# EAGLE design cm3_basic (EAGLE 9.4.2)

## Sheet 1 of 2
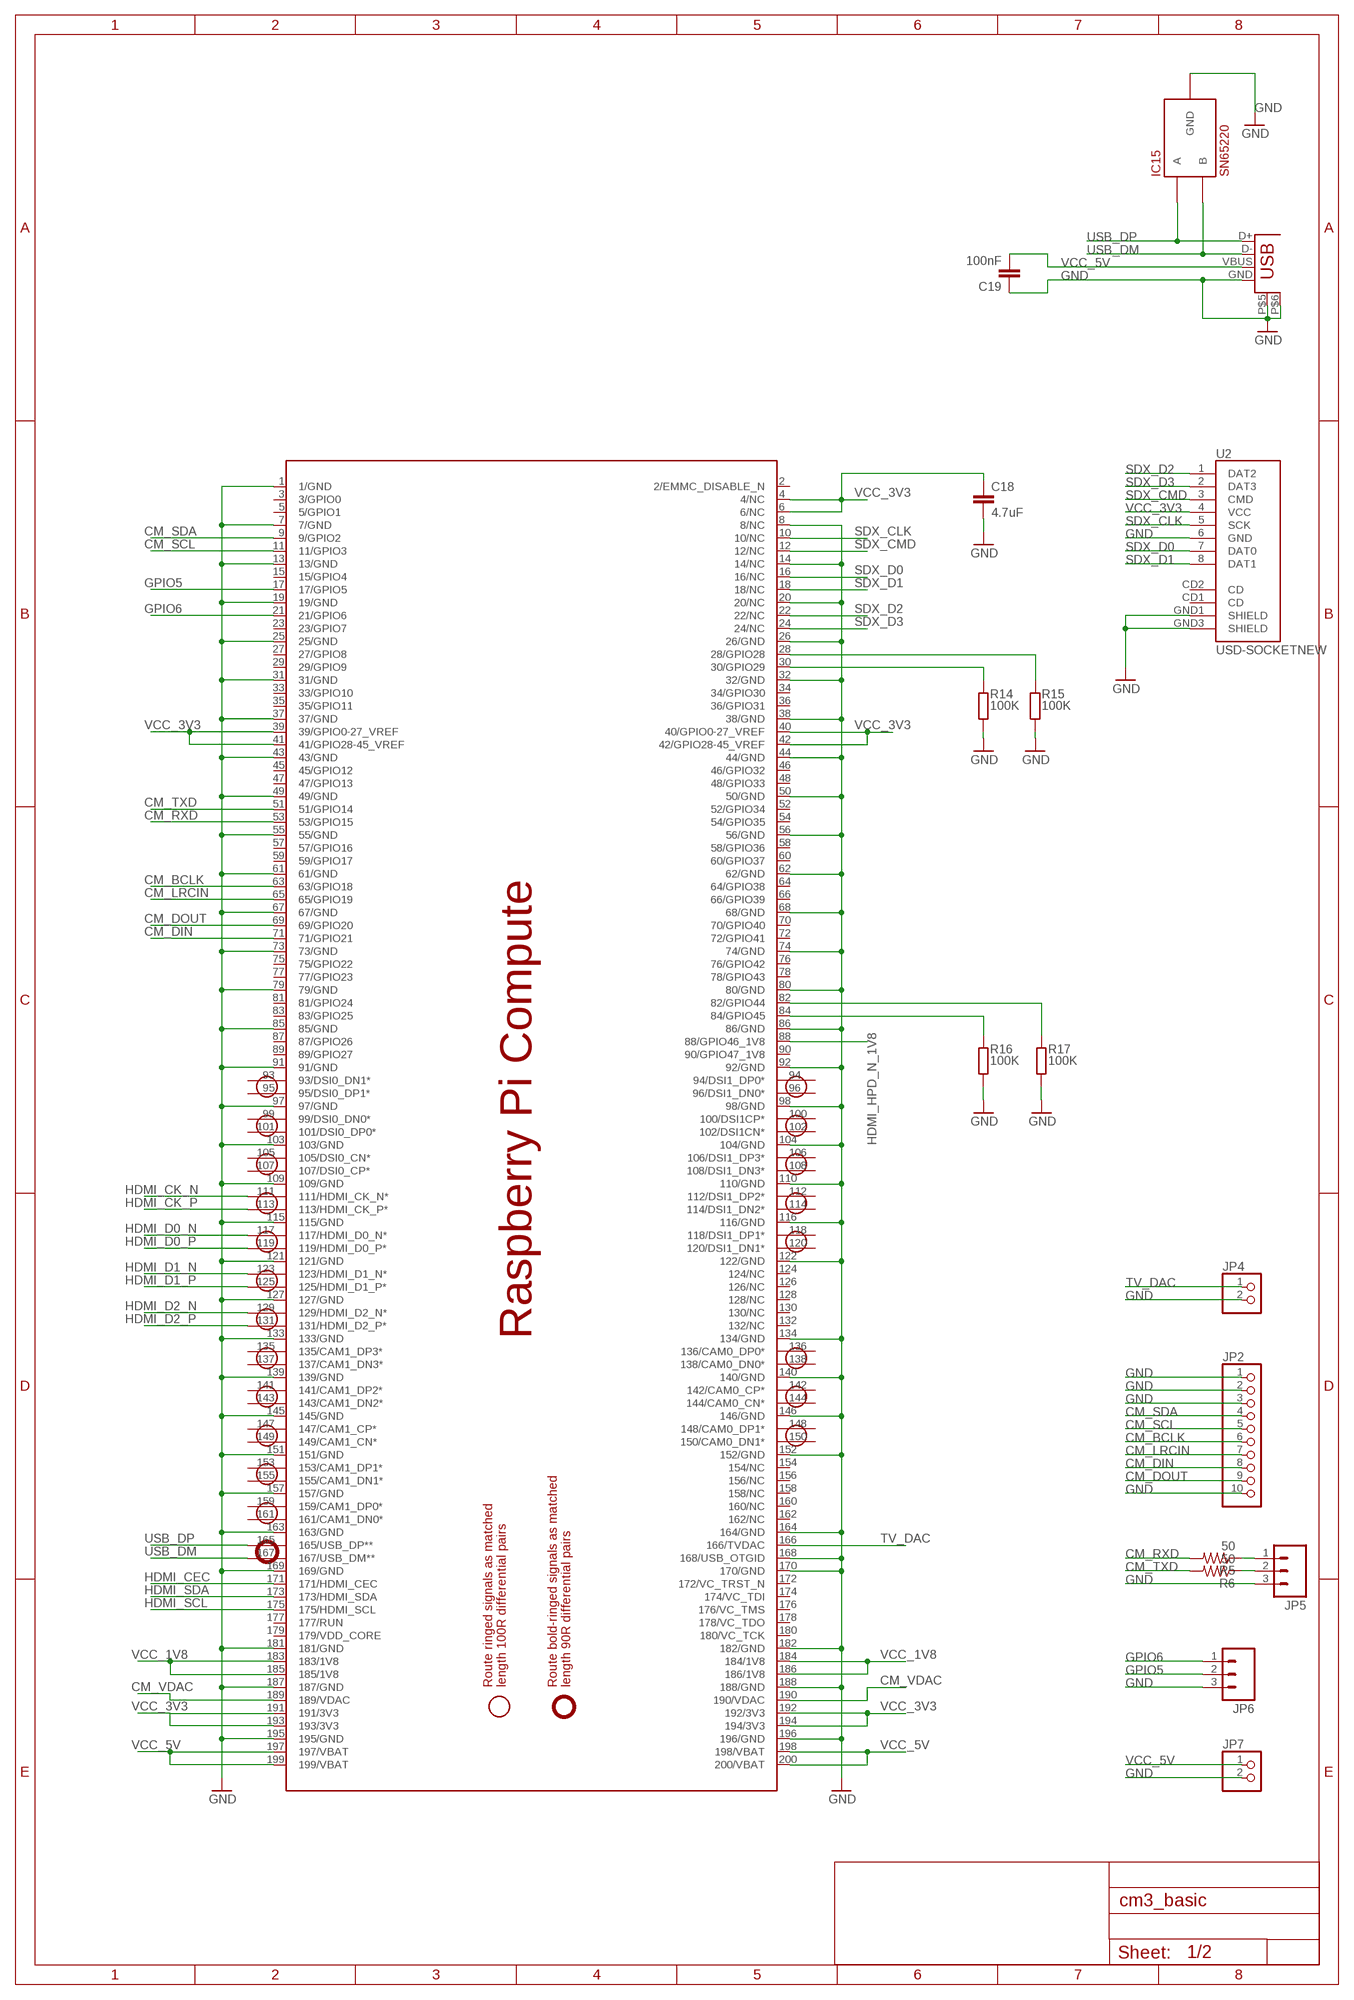
[diagram p0: schematic, sheet 1]

### Parts
C18  4.7uF  C-EUC1608  [C1608]
C19  100nF  CAP0603-CAP  [0603-CAP]
IC15  SN65220  [SOT23-6L]
JP2  PINHD-1X10  [1X10]
JP3  USB-A  USB-A-SMD  [USB-A-S-NOSILK-FEMALE]
JP4  PINHD-1X2  [1X02]
JP5  M03LOCK_LONGPADS  [1X03_LOCK_LONGPADS]
JP6  M03LOCK_LONGPADS  [1X03_LOCK_LONGPADS]
JP7  PINHD-1X2  [1X02]
R5  50  RESISTOR0603-RES  [0603-RES]
R6  50  RESISTOR0603-RES  [0603-RES]
R14  100K  R-EU_R0603  [R0603]
R15  100K  R-EU_R0603  [R0603]
R16  100K  R-EU_R0603  [R0603]
R17  100K  R-EU_R0603  [R0603]
SODIMM  RPI_COMPUTE  [RPI_COMPUTE]
U2  USD-SOCKETNEW  [MICRO-SD-SOCKET-PP]

### Nets
CM_BCLK: JP2.6 SODIMM.63(63/GPIO18)
CM_DIN: JP2.8 SODIMM.71(71/GPIO21)
CM_DOUT: JP2.9 SODIMM.69(69/GPIO20)
CM_LRCIN: JP2.7 SODIMM.65(65/GPIO19)
CM_RXD: R5.2 SODIMM.53(53/GPIO15)
CM_SCL: JP2.5 SODIMM.11(11/GPIO3)
CM_SDA: JP2.4 SODIMM.9(9/GPIO2)
CM_TXD: R6.2 SODIMM.51(51/GPIO14)
CM_VDAC: SODIMM.189(189/VDAC) SODIMM.190(190/VDAC) ; also sheet 2
GND: C18.2 C19.1 IC15.2(GND) IC15.5(GND) JP2.1 JP2.2 JP2.3 JP2.10 JP3.GND JP3.P$5(SHIELD1) JP3.P$6(SHIELD2) JP4.2 JP5.3 JP6.3 JP7.2 R14.1 R15.1 R16.1 R17.1 SODIMM.1(1/GND) SODIMM.7(7/GND) SODIMM.8(8/NC) SODIMM.13(13/GND) SODIMM.14(14/NC) SODIMM.19(19/GND) SODIMM.20(20/NC) SODIMM.25(25/GND) SODIMM.26(26/GND) SODIMM.31(31/GND) SODIMM.32(32/GND) SODIMM.37(37/GND) SODIMM.38(38/GND) SODIMM.43(43/GND) SODIMM.44(44/GND) SODIMM.49(49/GND) SODIMM.50(50/GND) SODIMM.55(55/GND) SODIMM.56(56/GND) SODIMM.61(61/GND) SODIMM.62(62/GND) SODIMM.67(67/GND) SODIMM.68(68/GND) SODIMM.73(73/GND) SODIMM.74(74/GND) SODIMM.79(79/GND) SODIMM.80(80/GND) SODIMM.85(85/GND) SODIMM.86(86/GND) SODIMM.91(91/GND) SODIMM.92(92/GND) SODIMM.97(97/GND) SODIMM.98(98/GND) SODIMM.103(103/GND) SODIMM.104(104/GND) SODIMM.109(109/GND) SODIMM.110(110/GND) SODIMM.115(115/GND) SODIMM.116(116/GND) SODIMM.121(121/GND) SODIMM.122(122/GND) SODIMM.127(127/GND) SODIMM.133(133/GND) SODIMM.134(134/GND) SODIMM.139(139/GND) SODIMM.140(140/GND) SODIMM.145(145/GND) SODIMM.146(146/GND) SODIMM.151(151/GND) SODIMM.152(152/GND) SODIMM.157(157/GND) SODIMM.163(163/GND) SODIMM.164(164/GND) SODIMM.168(168/USB_OTGID) SODIMM.169(169/GND) SODIMM.170(170/GND) SODIMM.181(181/GND) SODIMM.182(182/GND) SODIMM.187(187/GND) SODIMM.188(188/GND) SODIMM.195(195/GND) SODIMM.196(196/GND) U2.6(GND) U2.GND1(SHIELD) U2.GND3(SHIELD) ; also sheet 2
GPIO5: JP6.2 SODIMM.17(17/GPIO5)
GPIO6: JP6.1 SODIMM.21(21/GPIO6)
HDMI_CEC: SODIMM.171(171/HDMI_CEC) ; also sheet 2
HDMI_CK_N: SODIMM.111(111/HDMI_CK_N*) ; also sheet 2
HDMI_CK_P: SODIMM.113(113/HDMI_CK_P*) ; also sheet 2
HDMI_D0_N: SODIMM.117(117/HDMI_D0_N*) ; also sheet 2
HDMI_D0_P: SODIMM.119(119/HDMI_D0_P*) ; also sheet 2
HDMI_D1_N: SODIMM.123(123/HDMI_D1_N*) ; also sheet 2
HDMI_D1_P: SODIMM.125(125/HDMI_D1_P*) ; also sheet 2
HDMI_D2_N: SODIMM.129(129/HDMI_D2_N*) ; also sheet 2
HDMI_D2_P: SODIMM.131(131/HDMI_D2_P*) ; also sheet 2
HDMI_HPD_N_1V8: SODIMM.88(88/GPIO46_1V8) ; also sheet 2
HDMI_SCL: SODIMM.175(175/HDMI_SCL) ; also sheet 2
HDMI_SDA: SODIMM.173(173/HDMI_SDA) ; also sheet 2
N$3: JP5.1 R5.1
N$4: JP5.2 R6.1
N$8: R16.2 SODIMM.84(84/GPIO45)
N$9: R15.2 SODIMM.28(28/GPIO28)
N$10: R14.2 SODIMM.30(30/GPIO29)
N$11: R17.2 SODIMM.82(82/GPIO44)
SDX_CLK: SODIMM.10(10/NC) U2.5(SCK)
SDX_CMD: SODIMM.12(12/NC) U2.3(CMD)
SDX_D0: SODIMM.16(16/NC) U2.7(DAT0)
SDX_D1: SODIMM.18(18/NC) U2.8(DAT1)
SDX_D2: SODIMM.22(22/NC) U2.1(DAT2)
SDX_D3: SODIMM.24(24/NC) U2.2(DAT3)
TV_DAC: JP4.1 SODIMM.166(166/TVDAC)
USB_DM: IC15.4(B) JP3.D- SODIMM.167(167/USB_DM**)
USB_DP: IC15.6(A) JP3.D+ SODIMM.165(165/USB_DP**)
VCC_1V8: SODIMM.183(183/1V8) SODIMM.184(184/1V8) SODIMM.185(185/1V8) SODIMM.186(186/1V8) ; also sheet 2
VCC_3V3: C18.1 SODIMM.4(4/NC) SODIMM.6(6/NC) SODIMM.39(39/GPIO0-27_VREF) SODIMM.40(40/GPIO0-27_VREF) SODIMM.41(41/GPIO28-45_VREF) SODIMM.42(42/GPIO28-45_VREF) SODIMM.191(191/3V3) SODIMM.192(192/3V3) SODIMM.193(193/3V3) SODIMM.194(194/3V3) U2.4(VCC) ; also sheet 2
VCC_5V: C19.2 JP3.VBUS JP7.1 SODIMM.197(197/VBAT) SODIMM.198(198/VBAT) SODIMM.199(199/VBAT) SODIMM.200(200/VBAT) ; also sheet 2
Unconnected: SODIMM.2(2/EMMC_DISABLE_N) SODIMM.3(3/GPIO0) SODIMM.5(5/GPIO1) SODIMM.15(15/GPIO4) SODIMM.23(23/GPIO7) SODIMM.27(27/GPIO8) SODIMM.29(29/GPIO9) SODIMM.33(33/GPIO10) SODIMM.34(34/GPIO30) SODIMM.35(35/GPIO11) SODIMM.36(36/GPIO31) SODIMM.45(45/GPIO12) SODIMM.46(46/GPIO32) SODIMM.47(47/GPIO13) SODIMM.48(48/GPIO33) SODIMM.52(52/GPIO34) SODIMM.54(54/GPIO35) SODIMM.57(57/GPIO16) SODIMM.58(58/GPIO36) SODIMM.59(59/GPIO17) SODIMM.60(60/GPIO37) SODIMM.64(64/GPIO38) SODIMM.66(66/GPIO39) SODIMM.70(70/GPIO40) SODIMM.72(72/GPIO41) SODIMM.75(75/GPIO22) SODIMM.76(76/GPIO42) SODIMM.77(77/GPIO23) SODIMM.78(78/GPIO43) SODIMM.81(81/GPIO24) SODIMM.83(83/GPIO25) SODIMM.87(87/GPIO26) SODIMM.89(89/GPIO27) SODIMM.90(90/GPIO47_1V8) SODIMM.93(93/DSI0_DN1*) SODIMM.94(94/DSI1_DP0*) SODIMM.95(95/DSI0_DP1*) SODIMM.96(96/DSI1_DN0*) SODIMM.99(99/DSI0_DN0*) SODIMM.100(100/DSI1CP*) SODIMM.101(101/DSI0_DP0*) SODIMM.102(102/DSI1CN*) SODIMM.105(105/DSI0_CN*) SODIMM.106(106/DSI1_DP3*) SODIMM.107(107/DSI0_CP*) SODIMM.108(108/DSI1_DN3*) SODIMM.112(112/DSI1_DP2*) SODIMM.114(114/DSI1_DN2*) SODIMM.118(118/DSI1_DP1*) SODIMM.120(120/DSI1_DN1*) SODIMM.124(124/NC) SODIMM.126(126/NC) SODIMM.128(128/NC) SODIMM.130(130/NC) SODIMM.132(132/NC) SODIMM.135(135/CAM1_DP3*) SODIMM.136(136/CAM0_DP0*) SODIMM.137(137/CAM1_DN3*) SODIMM.138(138/CAM0_DN0*) SODIMM.141(141/CAM1_DP2*) SODIMM.142(142/CAM0_CP*) SODIMM.143(143/CAM1_DN2*) SODIMM.144(144/CAM0_CN*) SODIMM.147(147/CAM1_CP*) SODIMM.148(148/CAM0_DP1*) SODIMM.149(149/CAM1_CN*) SODIMM.150(150/CAM0_DN1*) SODIMM.153(153/CAM1_DP1*) SODIMM.154(154/NC) SODIMM.155(155/CAM1_DN1*) SODIMM.156(156/NC) SODIMM.158(158/NC) SODIMM.159(159/CAM1_DP0*) SODIMM.160(160/NC) SODIMM.161(161/CAM1_DN0*) SODIMM.162(162/NC) SODIMM.172(172/VC_TRST_N) SODIMM.174(174/VC_TDI) SODIMM.176(176/VC_TMS) SODIMM.177(177/RUN) SODIMM.178(178/VC_TDO) SODIMM.179(179/VDD_CORE) SODIMM.180(180/VC_TCK) U2.CD1(CD) U2.CD2(CD)

## Sheet 2 of 2
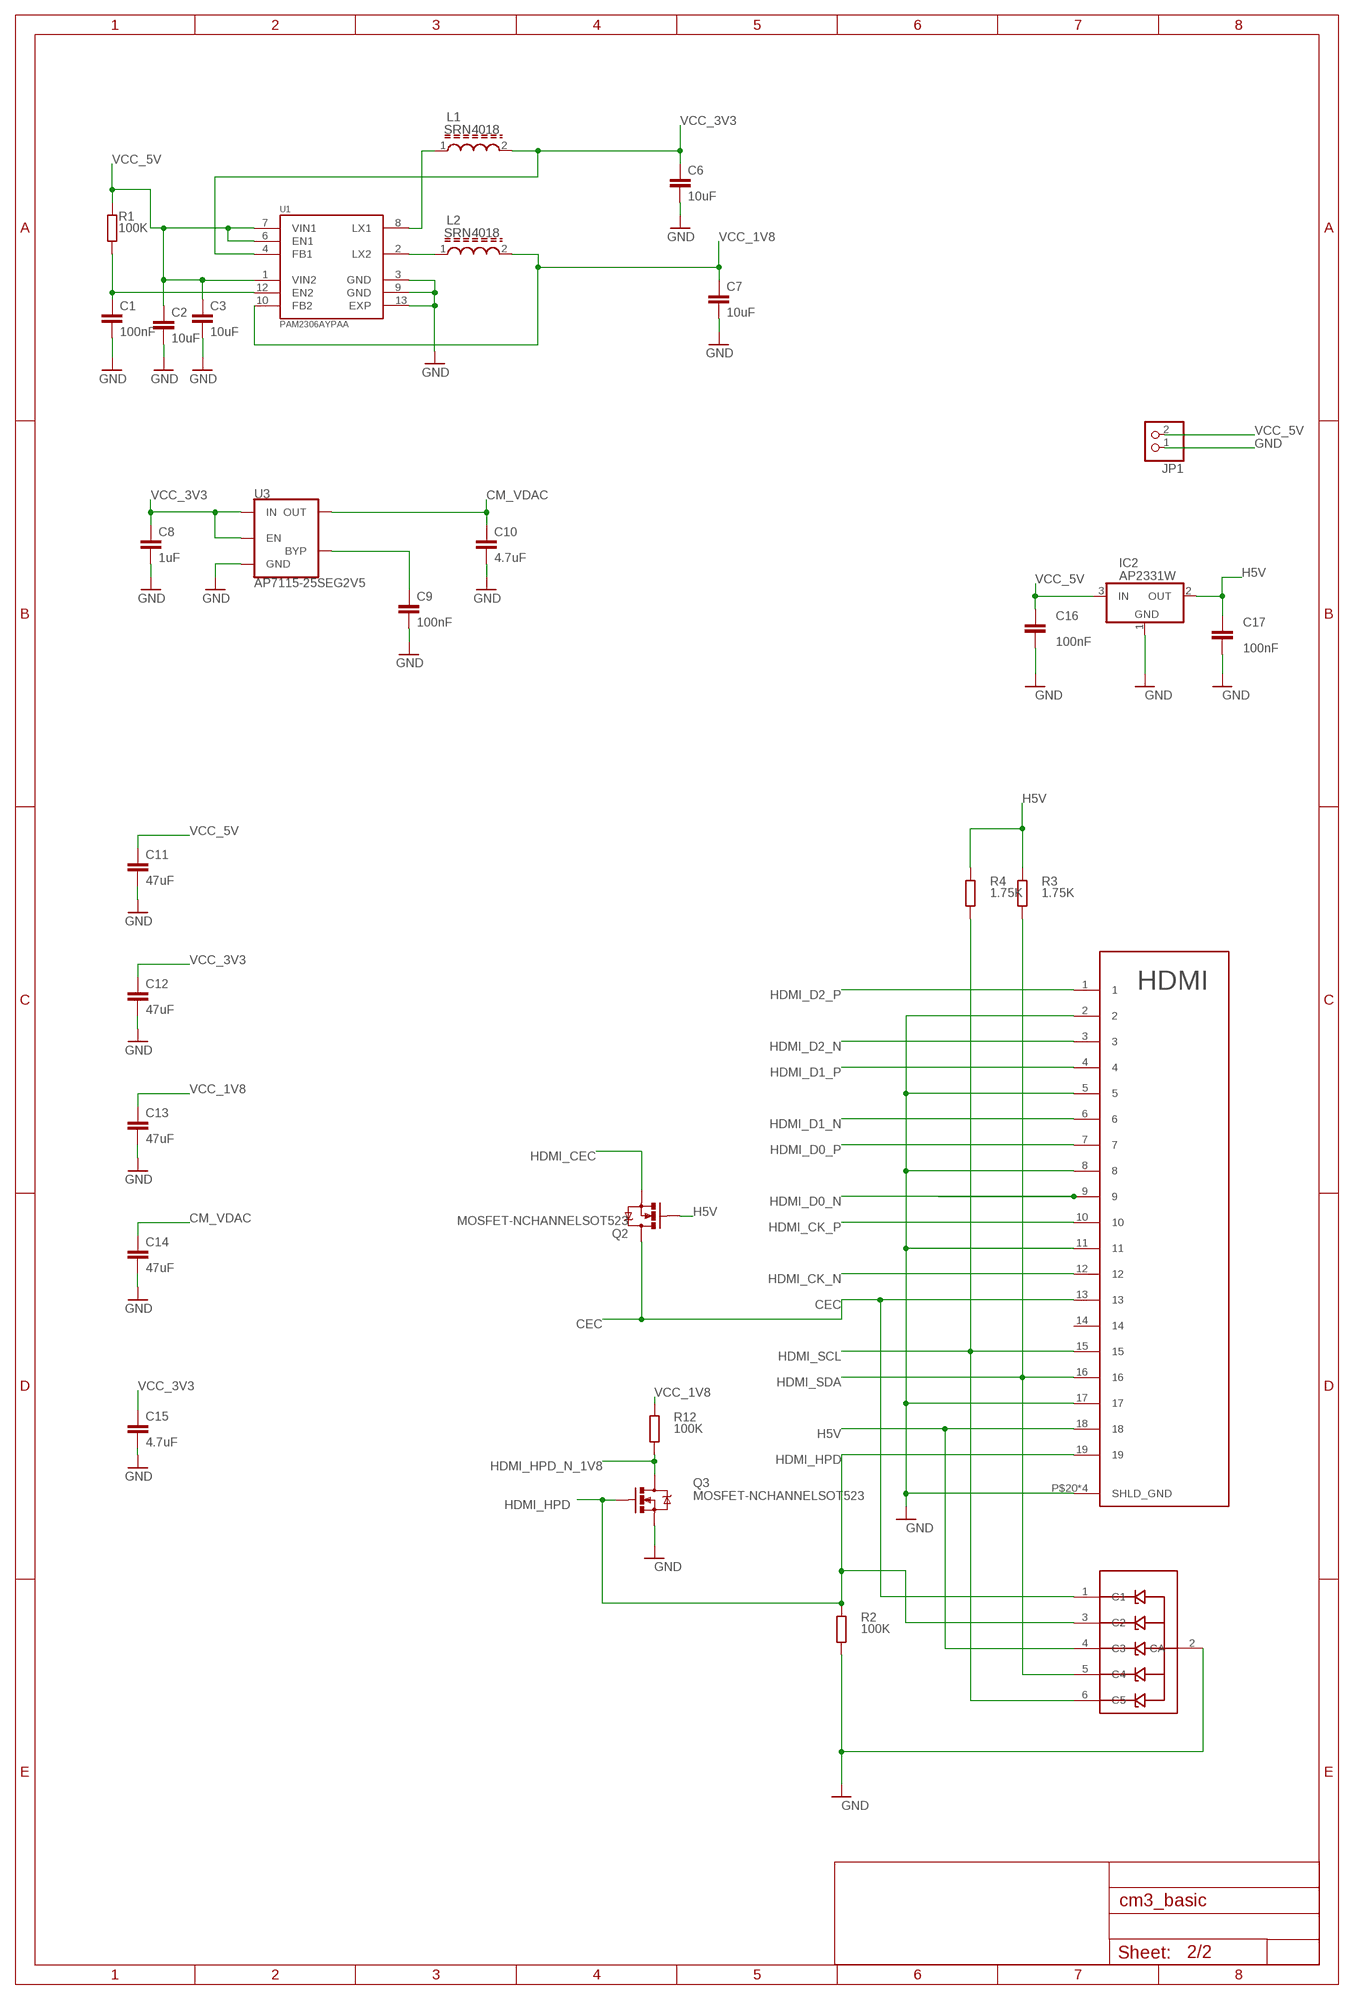
[diagram p1: schematic, sheet 2]

### Parts
C1  100nF  C-EUC0603  [C0603]
C2  10uF  C-EUC0805  [C0805]
C3  10uF  C-EUC0805  [C0805]
C6  10uF  C-EUC0805  [C0805]
C7  10uF  C-EUC0805  [C0805]
C8  1uF  C-EUC0603  [C0603]
C9  100nF  C-EUC0603  [C0603]
C10  4.7uF  C-EUC0603  [C0603]
C11  47uF  C-EUC3216  [C3216]
C12  47uF  C-EUC3216  [C3216]
C13  47uF  C-EUC3216  [C3216]
C14  47uF  C-EUC3216  [C3216]
C15  4.7uF  C-EUC0603  [C0603]
C16  100nF  C-EUC0603  [C0603]
C17  100nF  C-EUC0603  [C0603]
IC1  PESD3V3L5UYSOT363  [SOT363-INFINION]
IC2  AP2331W  AP2331WCB  [SOT23]
JP1  PINHD-1X2  [1X02]
L1  SRN4018  [INDP4040X180N]
L2  SRN4018  [INDP4040X180N]
Q2  MOSFET-NCHANNELSOT523  [SOT523]
Q3  MOSFET-NCHANNELSOT523  [SOT523]
R1  100K  R-EU_R0603  [R0603]
R2  100K  R-EU_R0603  [R0603]
R3  1.75K  R-EU_R0603  [R0603]
R4  1.75K  R-EU_R0603  [R0603]
R12  100K  R-EU_R0603  [R0603]
U1  PAM2306AYPAA  [SON45P300X300X80-13N]
U3  AP7115-25SEG2V5  [SC70]
U4  HDMI  [HDMI]

### Nets
CEC: IC1.1(C1) Q2.3(D) U4.13
CM_VDAC: C10.1 C14.1 U3.5(OUT) ; also sheet 1
GND: C1.2 C2.2 C3.2 C6.2 C7.2 C8.2 C9.2 C10.2 C11.2 C12.2 C13.2 C14.2 C15.2 C16.2 C17.2 IC1.2(CA) IC2.1(GND) JP1.1 Q3.2(S) R2.1 U1.3(GND) U1.9(GND) U1.13(EXP) U3.2(GND) U4.2 U4.5 U4.8 U4.11 U4.17 U4.P$20(SHLD_GND) U4.P$21(SHLD_GND) U4.P$22(SHLD_GND) U4.P$23(SHLD_GND) ; also sheet 1
H5V: C17.1 IC1.4(C3) IC2.2(OUT) Q2.1(G) R3.2 R4.2 U4.18
HDMI_CEC: Q2.2(S) ; also sheet 1
HDMI_CK_N: U4.12 ; also sheet 1
HDMI_CK_P: U4.10 ; also sheet 1
HDMI_D0_N: U4.9 ; also sheet 1
HDMI_D0_P: U4.7 ; also sheet 1
HDMI_D1_N: U4.6 ; also sheet 1
HDMI_D1_P: U4.4 ; also sheet 1
HDMI_D2_N: U4.3 ; also sheet 1
HDMI_D2_P: U4.1 ; also sheet 1
HDMI_HPD: IC1.3(C2) Q3.1(G) R2.2 U4.19
HDMI_HPD_N_1V8: Q3.3(D) R12.1 ; also sheet 1
HDMI_SCL: IC1.6(C5) R4.1 U4.15 ; also sheet 1
HDMI_SDA: IC1.5(C4) R3.1 U4.16 ; also sheet 1
N$1: L1.1 U1.8(LX1)
N$2: C1.1 R1.1 U1.12(EN2)
N$5: L2.1 U1.2(LX2)
N$7: C9.1 U3.4(BYP)
VCC_1V8: C7.1 C13.1 L2.2 R12.2 U1.10(FB2) ; also sheet 1
VCC_3V3: C6.1 C8.1 C12.1 C15.1 L1.2 U1.4(FB1) U3.1(IN) U3.3(EN) ; also sheet 1
VCC_5V: C2.1 C3.1 C11.1 C16.1 IC2.3(IN) JP1.2 R1.2 U1.1(VIN2) U1.6(EN1) U1.7(VIN1) ; also sheet 1
Unconnected: U4.14

## Library data of the parts
C1 C9 C16 C17 = rcl:C-EU: CAPACITOR, European symbol; CID: 67; SPICEPREFIX: C
C2 C3 C6 C7 = rcl:C-EU: CAPACITOR, European symbol; CID: 351; SPICEPREFIX: C
C8 = rcl:C-EU: CAPACITOR, European symbol; CID: 73; SPICEPREFIX: C
C10 C15 C18 = rcl:C-EU: CAPACITOR, European symbol; CID: 353; SPICEPREFIX: C
C11-C14 = rcl:C-EU: CAPACITOR, European symbol; CID: 355; SPICEPREFIX: C
C19 = osborn:CAP: Capacitor Standard 0603 ceramic capacitor, and 0.1" leaded capacitor.; CID: 67
IC1 = osborn:PESD3V3L5UY; CID: 360
IC2 = AP2331W:AP2331W: AP2331W 0.2A SINGLE CHANNEL CURRENT-LIMITED LOAD SWITCH; CID: 358
IC15 = osborn:SN65220; CID: 314
JP1 JP4 JP7 = osborn:PINHD-1X2: PIN HEADER
JP2 = pinhead:PINHD-1X10: PIN HEADER
JP3 = osborn:USB: USB Connectors USB-B-PTH is fully proven SKU : PRT-00139/CONN-08278 USB-miniB is fully proven SKU : PRT-00587 USB-A-PCB is untested. USB-A-H is throughly reviewed, but untested. Spark Fun Electronics SKU : PRT-00437 USB-B-SMT is throughly reviewed, but untested. Needs silkscreen touching up. USB-A-S has not been used/tested USB-MB-H has not been used/tested USB-MICROB has been used. CONN-09505; CID: 181; PROD_ID: CONN-09520
JP5 JP6 = osborn:M03: Header 3 Standard 3-pin 0.1" header. Use with straight break away headers (SKU : PRT-00116), right angle break away headers (PRT-00553), swiss pins (PRT-00743), machine pins (PRT-00117), and female headers (PRT-00115). Molex polarized connector foot print use with SKU : PRT-08232 with associated crimp pins and housings.
L1 L2 = SRN4018:SRN4018: Inductor Power Semi-Shielded Wirewound; CID: 352
Q2 Q3 = osborn:MOSFET-NCHANNEL: Common NMOSFET Parts MFG P/N Store ID Prod ID FDD8780 TRANS-09984 SI7820DN TRANS-11055 FDS6630A IC-08089 2N7002PW TRANS-11151 FQP30N06L COM-10213 TRANS-10060 BSS123LT1G TRANS-08345 BSS138 TRANS-00830 BS170 2N7000; CID: 359
R1 R2 R12 R14-R17 = rcl:R-EU_: RESISTOR, European symbol; CID: 157; SPICEPREFIX: R
R3 R4 = rcl:R-EU_: RESISTOR, European symbol; CID: 357; SPICEPREFIX: R
R5 R6 = osborn:RESISTOR: Resistor Basic schematic elements and footprints for 0603, 1206, and PTH resistors.; CID: 343; SUPPLIER: none
SODIMM = e14_Rpi_Compute_RevC:RPI_COMPUTE: Device for a Raspberry PI Compute module. Note that the package is for a DDR2 connector of 'standard' orientation. Example: TE Connectivity P/N: 1565917-4, Newark P/N: 08P0616, Farnell P/N: 2112525 More information is available at http://www.element14.com/community/community/raspberry-pi/raspberry-pi-compute-module; CID: 356
U1 = PAM2306AYPAA:PAM2306AYPAA: PAM2306 Series 5.5V 1A Dual High Efficiency PWM Step Down DC-DC Converter-WDFN12; AVAILABILITY: Good; CID: 362; DESCRIPTION: IC REG BUCK ADJ 1A DL SYNC 12DFN; MF: Diodes Inc.; MP: PAM2306AYPAA; PACKAGE: WFDFN-12 Diodes Inc.; PRICE: 0.33 USD
U2 = osborn:USD-SOCKET: microSD Socket Push-push type uSD socket. Schematic element and footprint production proven. Spark Fun Electronics SKU : PRT-00127. tDoc lines correctly indicate media card edge positions when inserting (unlocked, locked, depressed).; CID: 182
U3 = AP7115-25SEG:AP7115-25SEG: AP7115-25SEG 150mA LOW DROPOUT LINEAR REGULATOR WITH SHUTDOWN; CID: 354
U4 = 00_cody:HDMI; CID: 361

## Net classes
1 power: width 0.508 mm

## Board
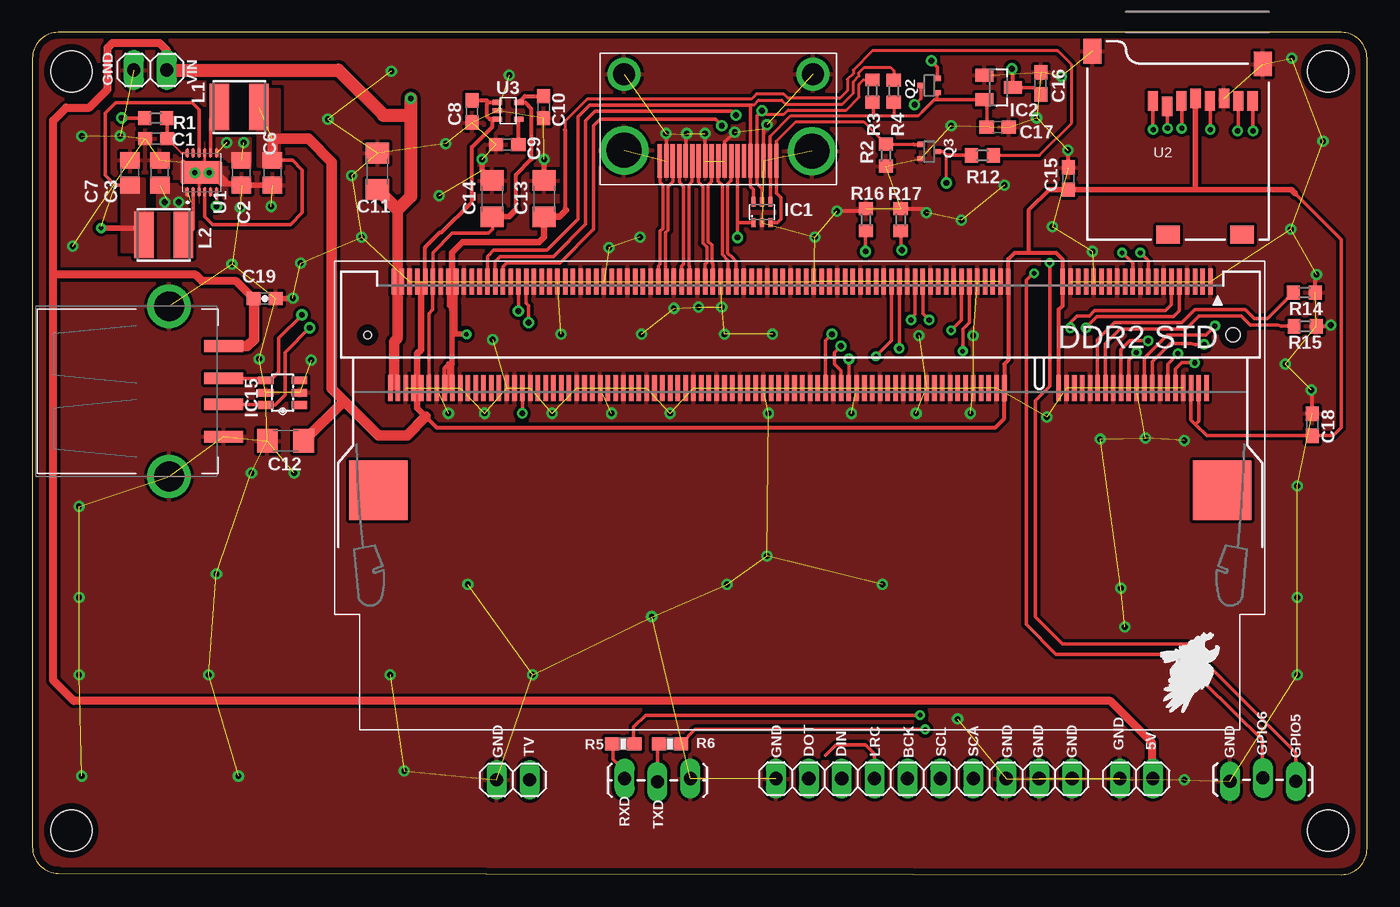
[diagram p2: board, top side]
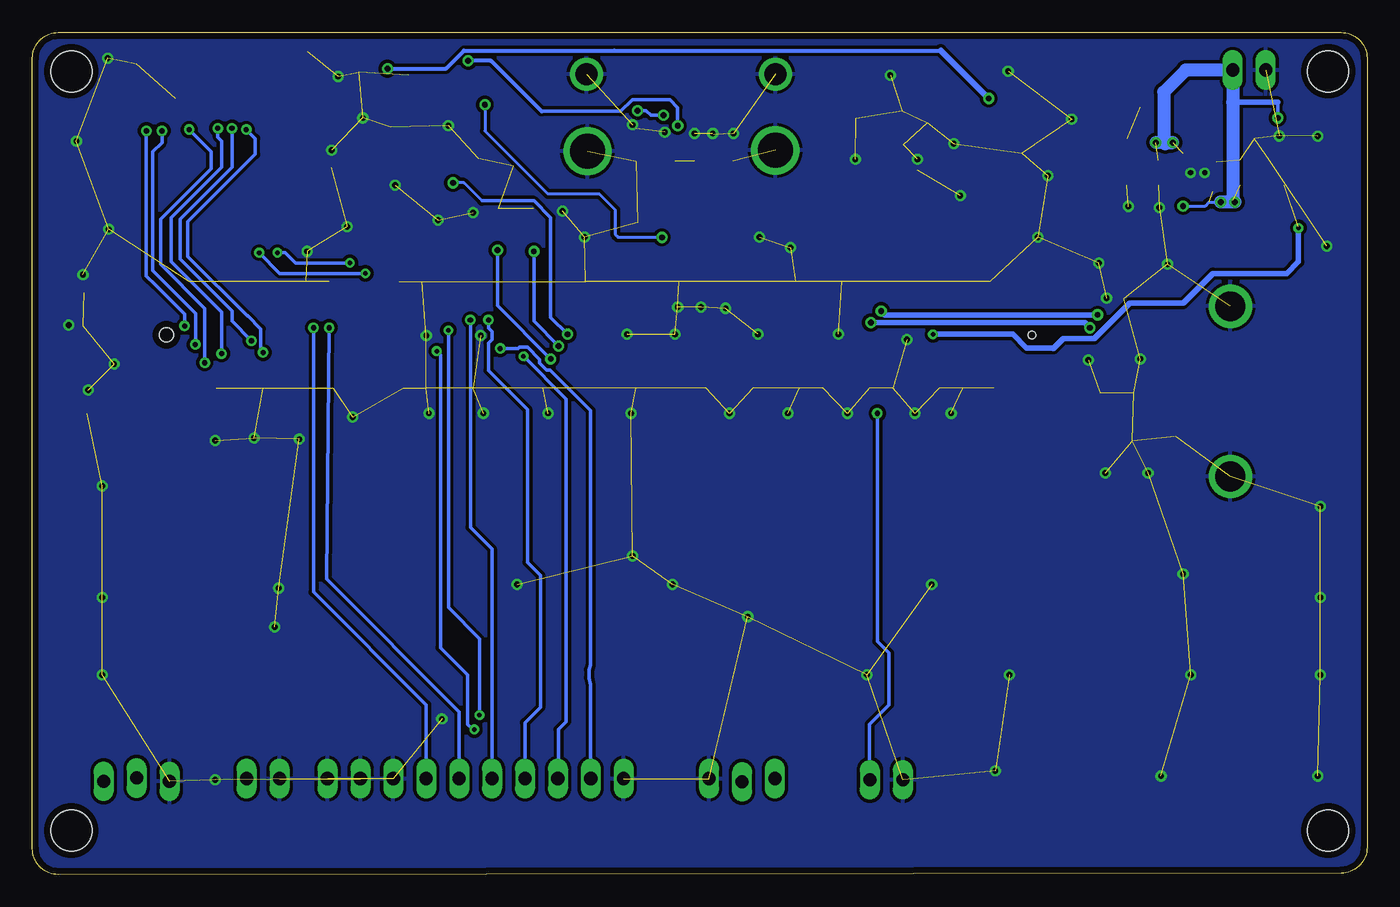
[diagram p3: board, bottom side, seen from below]

Size 103 x 65 mm. Coordinates in mm from the lower left corner, seen from the top.
Outline: 103,2 103,63 arc90 101,65 2,65 arc90 0,63 0,2.1 arc90 2,0.1 101,0 arc90 103,2
Copper layers (1*16): Top 0.035mm / dielectric 1.5mm / Bottom 0.035mm
Design rules "default *": minimum track width 6mil, minimum drill 0.35mm, track to track 8mil, track to pad 6mil, pad to pad 6mil, via to via 8mil, smd to smd 6mil, copper to edge 20mil, drill to drill 6mil, minimum pad ring 10mil, minimum via ring 8mil, stop-mask expansion 4mil, vias tented up to drill 0mil, thermal gap 10mil
Holes 3.17 mm at 3,3.4 3,62 100,62 100,3.4

### Footprints (pad centres in the part's own frame; a part is rotated, then mirrored left to right if it is on the bottom)
C0603 = smd 1.1 x 1: 1 -0.85,0; 2 0.85,0
C0805 = smd 1.3 x 1.5: 1 -0.95,0; 2 0.95,0
C3216 = smd 1.6 x 1.8: 1 -1.4,0; 2 1.4,0
C1608 = smd 1.1 x 1: 1 -0.85,0; 2 0.85,0
0603-CAP = smd 1.1 x 1: 1 -0.85,0; 2 0.85,0
SOT363-INFINION = smd 0.3 x 0.7: 1 -0.65,-0.8; 2 0,-0.8; 3 0.65,-0.8; 4 0.65,0.8; 5 0,0.8; 6 -0.65,0.8
SOT23 = smd 1 x 1.4: 1 -0.95,-1.1; 2 0.95,-1.1; 3 0,1.1
SOT23-6L = smd 0.6 x 1.2: 1 -0.95,-1.3; 2 0,-1.3; 3 0.95,-1.3; 4 0.95,1.3; 5 0,1.3; 6 -0.95,1.3
1X02 = drill 1.016 long: 1 -1.27,0; 2 1.27,0
1X10 = drill 1.016 long: 1 -11.43,0; 2 -8.89,0; 3 -6.35,0; 4 -3.81,0; 5 -1.27,0; 6 1.27,0; 7 3.81,0; 8 6.35,0; 9 8.89,0; 10 11.43,0
USB-A-S-NOSILK-FEMALE = smd 3 x 0.9: D+ 4.212,-1; D- 4.212,1; GND 4.212,-3.5; VBUS 4.212,3.5 | drill 2.311: P$5 0,-6.566; P$6 0,6.566
1X03_LOCK_LONGPADS = drill 1.016 long: 1 0,0; 2 2.54,-0.254; 3 5.08,0
INDP4040X180N = smd 1.5 x 3.6: 1 -1.525,0; 2 1.525,0
SOT523 = smd 0.4 x 0.5: 1 -0.55,-0.65; 2 0.55,-0.65; 3 0,0.65
R0603 = smd 1 x 1.1: 1 -0.85,0; 2 0.85,0
0603-RES = smd 1.1 x 1: 1 -0.85,0; 2 0.85,0
RPI_COMPUTE = smd 0.35 x 2: 1 -31.38,-4.1; 2 -31.08,4.1; 3 -30.78,-4.1; 4 -30.48,4.1; 5 -30.18,-4.1; 6 -29.88,4.1; 7 -29.58,-4.1; 8 -29.28,4.1; 9 -28.98,-4.1; 10 -28.68,4.1; 11 -28.38,-4.1; 12 -28.08,4.1; 13 -27.78,-4.1; 14 -27.48,4.1; 15 -27.18,-4.1; 16 -26.88,4.1; 17 -26.58,-4.1; 18 -26.28,4.1; 19 -25.98,-4.1; 20 -25.68,4.1; 21 -25.38,-4.1; 22 -25.08,4.1; 23 -24.78,-4.1; 24 -24.48,4.1; 25 -24.18,-4.1; 26 -23.88,4.1; 27 -23.58,-4.1; 28 -23.28,4.1; 29 -22.98,-4.1; 30 -22.68,4.1; 31 -22.38,-4.1; 32 -22.08,4.1; 33 -21.78,-4.1; 34 -21.48,4.1; 35 -21.18,-4.1; 36 -20.88,4.1; 37 -20.58,-4.1; 38 -20.28,4.1; 39 -19.98,-4.1; 40 -19.68,4.1; 41 -15.78,-4.1; 42 -15.48,4.1; 43 -15.18,-4.1; 44 -14.88,4.1; 45 -14.58,-4.1; 46 -14.28,4.1; 47 -13.98,-4.1; 48 -13.68,4.1; 49 -13.38,-4.1; 50 -13.08,4.1; 51 -12.78,-4.1; 52 -12.48,4.1; 53 -12.18,-4.1; 54 -11.88,4.1; 55 -11.58,-4.1; 56 -11.28,4.1; 57 -10.98,-4.1; 58 -10.68,4.1; 59 -10.38,-4.1; 60 -10.08,4.1; 61 -9.78,-4.1; 62 -9.48,4.1; 63 -9.18,-4.1; 64 -8.88,4.1; 65 -8.58,-4.1; 66 -8.28,4.1; 67 -7.98,-4.1; 68 -7.68,4.1; 69 -7.38,-4.1; 70 -7.08,4.1; 71 -6.78,-4.1; 72 -6.48,4.1; 73 -6.18,-4.1; 74 -5.88,4.1; 75 -5.58,-4.1; 76 -5.28,4.1; 77 -4.98,-4.1; 78 -4.68,4.1; 79 -4.38,-4.1; 80 -4.08,4.1; 81 -3.78,-4.1; 82 -3.48,4.1; 83 -3.18,-4.1; 84 -2.88,4.1; 85 -2.58,-4.1; 86 -2.28,4.1; 87 -1.98,-4.1; 88 -1.68,4.1; 89 -1.38,-4.1; 90 -1.08,4.1; 91 -0.78,-4.1; 92 -0.48,4.1; 93 -0.18,-4.1; 94 0.12,4.1; 95 0.42,-4.1; 96 0.72,4.1; 97 1.02,-4.1; 98 1.32,4.1; 99 1.62,-4.1; 100 1.92,4.1; 101 2.22,-4.1; 102 2.52,4.1; 103 2.82,-4.1; 104 3.12,4.1; 105 3.42,-4.1; 106 3.72,4.1; 107 4.02,-4.1; 108 4.32,4.1; 109 4.62,-4.1; 110 4.92,4.1; 111 5.22,-4.1; 112 5.52,4.1; 113 5.82,-4.1; 114 6.12,4.1; 115 6.42,-4.1; 116 6.72,4.1; 117 7.02,-4.1; 118 7.32,4.1; 119 7.62,-4.1; 120 7.92,4.1; 121 8.22,-4.1; 122 8.52,4.1; 123 8.82,-4.1; 124 9.12,4.1; 125 9.42,-4.1; 126 9.72,4.1; 127 10.02,-4.1; 128 10.32,4.1; 129 10.62,-4.1; 130 10.92,4.1; 131 11.22,-4.1; 132 11.52,4.1; 133 11.82,-4.1; 134 12.12,4.1; 135 12.42,-4.1; 136 12.72,4.1; 137 13.02,-4.1; 138 13.32,4.1; 139 13.62,-4.1; 140 13.92,4.1; 141 14.22,-4.1; 142 14.52,4.1; 143 14.82,-4.1; 144 15.12,4.1; 145 15.42,-4.1; 146 15.72,4.1; 147 16.02,-4.1; 148 16.32,4.1; 149 16.62,-4.1; 150 16.92,4.1; 151 17.22,-4.1; 152 17.52,4.1; 153 17.82,-4.1; 154 18.12,4.1; 155 18.42,-4.1; 156 18.72,4.1; 157 19.02,-4.1; 158 19.32,4.1; 159 19.62,-4.1; 160 19.92,4.1; 161 20.22,-4.1; 162 20.52,4.1; 163 20.82,-4.1; 164 21.12,4.1; 165 21.42,-4.1; 166 21.72,4.1; 167 22.02,-4.1; 168 22.32,4.1; 169 22.62,-4.1; 170 22.92,4.1; 171 23.22,-4.1; 172 23.52,4.1; 173 23.82,-4.1; 174 24.12,4.1; 175 24.42,-4.1; 176 24.72,4.1; 177 25.02,-4.1; 178 25.32,4.1; 179 25.62,-4.1; 180 25.92,4.1; 181 26.22,-4.1; 182 26.52,4.1; 183 26.82,-4.1; 184 27.12,4.1; 185 27.42,-4.1; 186 27.72,4.1; 187 28.02,-4.1; 188 28.32,4.1; 189 28.62,-4.1; 190 28.92,4.1; 191 29.22,-4.1; 192 29.52,4.1; 193 29.82,-4.1; 194 30.12,4.1; 195 30.42,-4.1; 196 30.72,4.1; 197 31.02,-4.1; 198 31.32,4.1; 199 31.62,-4.1; 200 31.92,4.1 | smd 4.5 x 4.6: M1 -32.28,12; M2 32.82,12 | hole 1.1: -33.13,0 | hole 0.6: 33.67,0
SON45P300X300X80-13N = smd 0.8 x 0.25: 1 -1.5,1.125; 2 -1.5,0.675; 3 -1.5,0.225; 4 -1.5,-0.225; 5 -1.5,-0.675; 6 -1.5,-1.125; 7 1.5,-1.125; 8 1.5,-0.675; 9 1.5,-0.225; 10 1.5,0.225; 11 1.5,0.675; 12 1.5,1.125 | smd 1.75 x 2.65: 13 0,0
MICRO-SD-SOCKET-PP = smd 0.8 x 1.5: 1 -8.94,10.7; 2 -7.84,10.3; 3 -6.74,10.7; 4 -5.64,10.9; 5 -4.54,10.7; 6 -3.44,10.9; 7 -2.34,10.7; 8 -1.24,10.7 | smd 1.8 x 1.4: CD1 -2.05,0.4; CD2 -7.75,0.4 | smd 1.4 x 1.9: GND1 -13.6,14.55; GND3 -0.45,13.55
SC70 = smd 0.4 x 0.75: 1 -0.65,-0.825; 2 0,-0.825; 3 0.65,-0.825; 4 0.65,0.825; 5 -0.65,0.825
HDMI = smd 0.33 x 2.6: 1 11.75,0.75; 2 11.25,0.75; 3 10.75,0.75; 4 10.25,0.75; 5 9.75,0.75; 6 9.25,0.75; 7 8.75,0.75; 8 8.25,0.75; 9 7.75,0.75; 10 7.25,0.75; 11 6.75,0.75; 12 6.25,0.75; 13 5.75,0.75; 14 5.25,0.75; 15 4.75,0.75; 16 4.25,0.75; 17 3.75,0.75; 18 3.25,0.75; 19 2.75,0.75 | drill 2.7: P$20 0,0; P$23 14.5,-0.075 | drill 1.7: P$21 -0.065,-5.96; P$22 14.5,-5.96

### Placement (x,y rotation side)
C1  9.56,56.79 180 top
C2  16.13,54.17 270 top
C3  9.83,54.17 90 top
C6  18.53,54.17 270 top
C7  7.53,54.17 90 top
C8  33.94,58.89 270 top
C9  36.64,56.34 180 top
C10  39.46,59.23 270 top
C11  26.63,54.27 90 top
C12  19.53,33.47 180 top
C13  39.49,52.17 90 top
C14  35.48,52.17 90 top
C15  79.94,53.72 90 top
C16  77.81,61.06 90 top
C17  74.49,57.68 0 top
C18  98.76,34.72 90 top
C19  17.93,44.45 180 top
IC1  56.3,51.12 0 top
IC2  74.56,60.75 270 top
IC15  19.31,37.19 90 top
JP1  9.1,62.1 0 top
JP2  68.8,7.4 180 top
JP3  10.54,37.29 0 top
JP4  37.1,7.3 180 top
JP5  45.7,7.4 0 top
JP6  97.5,7.2 180 top
JP7  85.2,7.4 180 top
L1  15.97,59.24 0 top
L2  10.13,49.37 180 top
Q2  69.2,60.9 90 top
Q3  69.2,55.8 270 top
R1  9.52,58.38 180 top
R2  65.86,55.51 90 top
R3  64.82,60.48 270 top
R4  66.47,60.47 270 top
R5  45.6,10.1 0 top
R6  49.2,10.1 0 top
R12  73.31,55.51 0 top
R14  98.16,44.92 180 top
R15  98.21,42.32 180 top
R16  64.33,50.53 270 top
R17  67.01,50.53 270 top
SODIMM  59.53,41.65 180 top
U1  13.08,54.19 90 top
U2  95.4,49 0 top
U3  36.71,58.95 270 top
U4  60.17,55.82 180 top

### Tracks (layer width: path | path; a pad name or v marks a point on that pad's centre or on a via)
CEC  (via drill 0.45)
  Top 0.25: 68.56,59.9 v68.08,59.42
  Top 0.254: U4.13 54.42,50.32 | 54.42,50.32 v54.42,49.18 | IC1.1 54.42,50.32 | Q2.3 68.55,59.91 68.56,59.9
  Bottom 0.25: v68.08,59.42 68.08,57.38 63.24,52.54 59.26,52.54 58.03,51.31 58.03,49.41 57.81,49.18 v54.42,49.18
CM_BCLK  (via drill 0.4)
  Top 0.254: SODIMM.63 68.71,43.29 v69.2,42.8
  Bottom 0.254: v69.2,42.8 69.2,26.8 67.53,25.13 JP2.6
CM_DIN  (via drill 0.35)
  Top 0.254: SODIMM.71 66.31,41.21 v65.1,40
  Bottom 0.254: v65.1,40 61.8,36.7 61.8,11.8 62.4,11.2 62.4,7.35 | 62.4,6.9 62.4,7.35 | 62.4,7.35 JP2.8
CM_DOUT  (via drill 0.4)
  Top 0.254: v66.9,40.6 66.9,40.4 v66.91,40.61 SODIMM.69
  Bottom 0.254: v66.9,40.6 65.5,40.6 65.39,40.71 64.81,40.71 63.86,39.76 63.86,39.49 63.31,38.94 63.04,38.94 59.91,35.81 59.91,16.16 60.06,15.81 60.06,15.19 59.91,14.64 JP2.9
CM_LRCIN  (via drill 0.4)
  Top 0.254: SODIMM.65 68.11,43.21 67.8,42.9 v67.8,42.8 | JP2.7 64.99,9.31 64.3,10 62,10 61.2,9.2
  Bottom 0.254: v67.8,42.8 67.8,42.17 67.54,41.91 67.54,41.29 67.8,41.03 67.8,38.9 64.8,35.9 64.8,24.1 63.8,23.1 63.8,12.9 64.99,11.71 JP2.7
CM_RXD  (via drill 0.35)
  Top 0.254: SODIMM.53 71.71,42.81 v70.9,42 | v68.5,12.3 47.3,12.3 46.4,11.4 46.4,10.15 R5.2
  Bottom 0.254: v70.9,42 70.9,20.6 68.5,18.2 v68.5,12.3
CM_SCL  (via drill 0.4)
  Top 0.254: SODIMM.11 87.91,44.01 87.41,43.51 81.97,43.51 81.55,43.1 80.6,43.1 80.1,42.6 v80.1,42.2
  Bottom 0.254: v80.1,42.2 80.3,22.8 70.07,12.57 JP2.5
CM_SDA  (via drill 0.4)
  Top 0.254: SODIMM.9 88.51,43.51 88.06,43.06 82.16,43.06 v81.3,42.2
  Bottom 0.254: v81.3,42.2 81.3,21.8 72.61,13.11 JP2.4
CM_TXD  (via drill 0.35)
  Top 0.254: SODIMM.51 72.31,42.61 71.8,42.1 v71.8,40.4 | R6.2 51.15,11.2 v68.9,11.2
  Bottom 0.254: v71.8,40.4 71.5,40.1 71.5,17.5 69.4,15.4 69.4,11.6 69,11.2 v68.9,11.2
CM_VDAC
  Top 0.254: SODIMM.190 30.61,43.31 30.9,43.6 SODIMM.189 30.91,48.01 32.4,49.5 35.2,49.5 35.5,49.8 35.5,50.58 35.48,50.6 C14.1
  Top 0.305: C10.1 38.02,60.08 U3.5 38,59.6 38.5,59.1 38.5,55.2 37.3,54 37.3,51.3
  Top 0.406: C14.1 36.77,50.77 37.3,51.3
GND  (via drill 0.4, 0.45)  (189 unrouted)
  Top 0.203: U1.9 13.3,54.41 U1.13 12.99,54.1 12.86,53.96 U1.3
  Top 0.254: U4.17 56.42,57.58 v56.7,57.86 | U4.11 53.42,56.52 v54.2,57.3 | U4.8 51.92,57.18 v51.9,57.2 | U4.5 50.42,57.12 v50.5,57.2 | U4.2 48.92,57.18 v48.9,57.2
  Top 0.305: IC2.1 73.95,61.7 | R17.1 68.72,51.38 v69,51.1 | R16.1 64.15,51.2 v62.1,51.2 | C15.2 79.94,55.86 v79.9,55.9 | R14.1 99.01,46.21 v99.1,46.3 | R15.1 100.12,42.32 v100.2,42.4 | C18.2 98.76,37.34 v98.7,37.4
  Top 0.406: C14.2 34.7,54.35 v34.7,55.2 | C13.2 v39.49,55.19 v39.5,55.2 | C19.1 20.05,44.45 v20.1,44.5 | 15.08,53.33 16.02,53.33 C2.2 C6.2 | 11.65,54.96 11.65,53.49 12.27,54.1 12.99,54.1 | 14.46,54.87 14.46,53.49 14.62,53.33 15.08,53.33 | U1.13 13.06,54.17 v12.53,54.17 | U1.13 13.1,54.17 v13.63,54.17 | U1.13 14.22,54.19 15.08,53.33
  Bottom 0.254: v56.7,57.86 56.7,57.88
  other vias: 24.63,53.94 18.43,51.57 16.03,51.47 6.77,57.01 32.1,35.6 34.9,35.6 40.1,35.6 44.7,35.6 49.2,35.6 72.4,35.6 68.2,35.6 63.2,35.6 56.8,35.6 40.8,41.7 47,41.7 53.4,41.7 57.1,41.7 68.4,41.6 72.6,41.6 77.5,58.4 70.9,57.8 75,53.2 71.7,50.5 60.4,49.2 44.5,48.4 46.9,49.2 35.5,41.3 3.8,57 3.1,48.5 3.6,28.4 3.6,21.4 3.6,15.4 13.6,15.4 27.6,15.4 38.6,15.4 47.8,19.9 56.7,24.6 71.4,12 84.3,19.1 84,22.1 65.6,22.4 53.6,22.4 33.6,22.4 97.6,21.4 97.6,15.4 99.6,56.6 78.7,50 97.1,49.8 96.7,39.4 16.9,31 20.2,31 21.5,39.7 17.5,39.8 15.4,47.1 20.7,47.2 25.4,49.2 22.8,58.3 31.9,56.4 31.4,52.4 27.7,62 36.8,61.7 49.5,43.7 51.4,43.8 53.2,43.8 81.8,48.1 85.9,33.7 78.3,35.3 82.4,33.6 88.9,33.5 79.4,61.6 15.9,7.6 88.9,7.3 14.2,23.2 97.6,30 97.2,63 3.8,7.6 28.7,8
  pour Top (isolate 0.254, rank 2): -1.02,71.89 102.98,71.89 103,-4.6 0,-4.6
  pour Bottom (isolate 0.254): 0.7,73.2 103.7,73.2 103,-3.9 0,-3.9
GPIO5  (via drill 0.35)
  Top 0.254: JP6.2 94.9,7.51 94.9,10.4 88.2,17 79,17 76.7,19.3 76.7,45.9 77.3,46.5 v77.3,46.4 | v85.5,48 86.11,47.39 SODIMM.17
  Bottom 0.254: v77.3,46.4 83.9,46.4 v85.5,48
GPIO6  (via drill 0.35)
  Top 0.254: SODIMM.21 84.91,47.19 v84.1,48 | v78.5,47.21 78.5,37.7 77.4,36.6 77.4,19.9 79.5,17.8 89.1,17.8 97.5,9.4 JP6.1
  Bottom 0.254: v84.1,48 83.5,48 82.7,47.2 v78.5,47.2 v78.5,47.21
H5V
  Top 0.25: 56.92,56.97 58.5,58.55 64.9,58.55 66.5,58.55 | 68.7,58.89 68.36,58.55 66.5,58.55 | R4.2 66.47,58.58 66.5,58.55
  Top 0.254: 73.39,59.87 IC2.2 | IC2.2 73.64,59.62 C17.1 | IC1.4 56.95,55.04 U4.18 56.92,56.97 | R3.2 arc-90 64.9,59.55 64.9,58.55 | IC2.2 69.8,59.8 | 69.8,59.8 69.61,59.8 68.7,58.89 | Q2.1 69.8,60.3 69.8,59.8
HDMI_CEC  (via drill 0.45)
  Top 0.254: SODIMM.171 36.31,46.91 36.6,47.2 40.7,47.2 43.3,49.8 43.3,57.8 43.8,58.3 52.7,58.3 v53.2,57.8 | v69.37,62.81 69.85,62.33 Q2.2
  Top 0.305: 69.42,62.91 v69.37,62.81
  Bottom 0.25: 69.63,62.73 v69.37,62.81
  Bottom 0.254: v53.2,57.8 53.2,59.2 53.8,59.8 56.7,59.8 57.6,58.9 63.7,58.9
  Bottom 0.305: 63.7,58.9 67.61,62.81 v69.37,62.81
HDMI_CK_N
  Top 0.152: 54.01,47.61
  Top 0.254: U4.12 53.92,53.57 53.65,53.3 53.65,47.96 54.01,47.61 54.31,47.31 SODIMM.111
HDMI_CK_P
  Top 0.152: 53.69,46.69 53.7,46.5 SODIMM.113
  Top 0.254: U4.10 52.92,53.53 53.25,53.2 53.25,47.84 53.69,47.39 53.69,46.69
HDMI_D0_N
  Top 0.254: U4.9 52.42,53.47 52.15,53.2 52.15,48.86 52.45,48.56 52.45,47.2 52.51,47.14 SODIMM.117
HDMI_D0_P
  Top 0.152: SODIMM.119
  Top 0.254: U4.7 51.42,53.43 51.75,53.1 51.75,48.74 52.05,48.44 52.05,47.25 51.9,47.1 SODIMM.119
HDMI_D1_N
  Top 0.254: U4.6 50.92,53.47 50.65,53.2 50.65,47 50.71,46.94 SODIMM.123
HDMI_D1_P
  Top 0.254: U4.4 49.92,53.43 50.25,53.1 50.25,47.1 50.11,46.96 SODIMM.125
HDMI_D2_N
  Top 0.152: 48.85,45.81 SODIMM.129
  Top 0.254: U4.3 49.42,53.47 49.05,53.1 49.05,49.74 48.85,49.54 48.85,45.81
HDMI_D2_P
  Top 0.254: U4.1 48.42,53.43 48.65,53.2 48.65,49.86 48.45,49.66 48.45,47.1 48.31,46.96 SODIMM.131
HDMI_HPD
  Top 0.25: 68.23,56.36 68,56.36 R2.2 64.93,57.29 64.16,58.09 64.15,58.1 58.92,58.1 57.43,56.61
  Top 0.254: 57.43,56.61 U4.19 57.42,52.59 57.78,52.23 57.78,50.6 57.5,50.32 IC1.3 | Q3.1 68.01,56.35 68,56.36
HDMI_HPD_N_1V8  (via drill 0.45)
  Top 0.25: v70.54,53.38 70.54,55.5 70.55,55.51
  Top 0.254: 72.44,55.51 70.55,55.51 70.26,55.8 Q3.3 | 72.44,55.51 R12.1 | SODIMM.88 61.21,41.21 v61.7,41.7 | 72.54,55.41 72.44,55.51
  Bottom 0.25: 68.3,52 69.7,53.4 70.55,53.4 v70.54,53.39 v70.54,53.38
  Bottom 0.254: v61.7,41.7 63,43 63,50.7 64.3,52 68.3,52
HDMI_SCL
  Top 0.25: 55.4,59.4 55.67,59.4 56.05,59.78 57.81,59.78 58.13,59.46 62.5,59.46 63.35,60.31 63.35,61.19 63.8,61.64 63.8,61.9 64.2,62.3 66.2,62.3 66.47,62.03 R4.1
  Top 0.254: SODIMM.175 35.11,47.71 35.6,48.2 39.7,48.2 42.1,50.6 42.1,58.5 43,59.4 55.4,59.4 55.4,55.09 U4.15 55.42,53.11 55.65,52.88 IC1.6
HDMI_SDA  (via drill 0.45)
  Top 0.25: v56.3,58.96 56.56,58.7 58.01,58.7 58.31,59.01 62.81,59.01 63.8,60 63.8,61 64.13,61.33 R3.1
  Top 0.254: SODIMM.173 35.71,47.31 36.1,47.7 40.2,47.7 42.7,50.2 42.7,58.2 43.4,58.9 54,58.9 v54.3,58.6 | v56.3,58.96 55.92,58.58 U4.16 55.92,53.31 56.3,52.93 IC1.5
  Bottom 0.254: v54.3,58.6 55.27,58.6 55.63,58.96 v56.3,58.96
N$1
  Top 0.254: U1.8 13.76,58.35 L1.1
N$2
  Top 0.203: U1.12 11.51,55.69 C1.1
  Top 0.254: R1.1 10.41,58.34 C1.1
N$3
  Top 0.254: R5.1 44.8,10.05 44.8,8.9 45.7,8 JP5.1
N$4
  Top 0.254: R6.1 48.24,9.99 JP5.2
N$5
  Top 0.2: 12.4,49.82 L2.1
  Top 0.254: U1.2 12.4,49.82
N$7
  Top 0.305: U3.4 37.49,58.26 C9.1
N$8  (via drill 0.45)
  Top 0.254: SODIMM.84 62.41,38.89 61.9,39.4 61.9,40.3 v62.4,40.8 | v64.3,48.1 64.3,49.65 R16.2
  Bottom 0.254: v62.4,40.8 64.3,42.7 v64.3,48.1
N$9
  Top 0.254: R15.2 96.38,42.32 96.1,42.4 94,42.4 93.3,43.1 90,43.1 89,42.1 83.9,42.1 82.8,41 82.81,40.99 SODIMM.28
N$10
  Top 0.254: R14.2 95.29,42.9 94.3,42.9 93.6,43.6 89.7,43.6 88.7,42.6 83.5,42.6 82.2,41.3 SODIMM.30
N$11  (via drill 0.45)
  Top 0.254: R17.2 67.01,48.29 v67.1,48.2 | SODIMM.82 63.01,39.69 v63,39.8
  Bottom 0.254: v67.1,48.2 67.1,43.9 v63,39.8
SDX_CLK  (via drill 0.4)
  Top 0.254: SODIMM.10 88.21,39.01 88.7,39.5 v89.7,39.5 | v90.9,57.5 90.9,59.66 U2.5
  Bottom 0.254: v89.7,39.5 89.7,43.7 93.1,47.1 93.1,50.6 89.2,54.5 89.2,55.8 v90.9,57.5
SDX_CMD  (via drill 0.4)
  Top 0.254: SODIMM.12 87.61,39.41 v88.4,40.2 | v88.7,57.6 88.7,59.66 U2.3
  Bottom 0.254: v88.4,40.2 88.4,43.4 92.3,47.3 92.3,50.7 88.4,54.6 88.4,56.6 88.7,56.9 v88.7,57.6
SDX_D0  (via drill 0.4)
  Top 0.254: SODIMM.16 86.41,39.61 87.8,41 89.4,41 89.69,40.91 v90.43,40.91 | U2.7 93.06,57.46 v93,57.4
  Bottom 0.254: v93,57.4 93,56.5 93.7,55.8 93.7,46.6 90.4,43.3 90.4,41 90.43,40.97 v90.43,40.91
SDX_D1  (via drill 0.4)
  Top 0.254: SODIMM.18 85.81,39.87 86.83,40.9 87.23,41.28 87.6,41.64 90.56,41.64 v91.26,42.34 91.4,42.4 | v94.2,57.4 94.16,57.44 U2.8
  Bottom 0.254: v91.26,42.34 91.26,43.26 93.5,45.5 94.2,46.19 v94.2,57.4
SDX_D2  (via drill 0.4)
  Top 0.254: SODIMM.22 84.61,39.71 v85.2,40.3 | v86.5,57.5 86.46,57.44 U2.1
  Bottom 0.254: v85.2,40.3 85.37,40.47 85.37,42.1 86.4,43.14 86.4,43.1 91,47.7 91,50.4 85.8,55.6 85.8,56.8 v86.5,57.5
SDX_D3  (via drill 0.4)
  Top 0.254: SODIMM.24 84.01,40.51 84.7,41.2 v86.1,41.2 | v87.6,57.6 87.6,59.26 U2.2
  Bottom 0.254: v86.1,41.2 87.6,42.7 87.6,43.5 91.6,47.5 91.6,50.6 87.6,54.6 v87.6,57.6
TV_DAC  (via drill 0.4)
  Top 0.254: SODIMM.166 v37.81,35.61 v37.8,35.6
  Bottom 0.254: v37.8,35.6 37.8,18 36.9,17.1 36.9,13.1 38.4,11.6 38.4,7.33 JP4.1
USB_DM  (via drill 0.45)
  Top 0.254: JP3.D- 17.86,38.29 IC15.4 18.34,38.14 19,38.8 19,41.4 v20.8,43.2 | v37.5,43.5 SODIMM.167
  Bottom 0.406: v20.8,43.2 37.2,43.2 v37.5,43.5
USB_DP  (via drill 0.45)
  Top 0.254: JP3.D+ 17.96,36.29 IC15.6 18.74,36.24 19.5,37 19.5,40.3 v21.4,42.2 | SODIMM.165 38.11,44.09 38.3,43.9 v38.3,42.6
  Bottom 0.406: v21.4,42.2 21.8,42.6 v38.3,42.6
VCC_1V8  (via drill 0.35)  (1 unrouted)
  Top 0.25: R12.2 77.71,55.51 80.2,58 80.2,62.5 79.13,63.57 64.83,63.57 63.35,62.09 63.35,61.83 62.89,61.38 62.89,60.49 62.31,59.91 58.31,59.91 58,60.23 55.86,60.23 55.48,59.85 42.81,59.85 41.1,58.14 41.1,57.48
  Top 0.254: SODIMM.184 | SODIMM.183 32.71,43.91 32.6,43.8 32.4,43.6 32.11,43.89 SODIMM.185 | U1.10 12.86,59.04 12.33,59.57 6.43,59.57 5.63,58.77 5.63,53.97 6.38,53.22 C7.1 | 8.61,49.87 L2.2
  Top 0.305: SODIMM.186 31.81,39.11 32.1,39.4 | 32.4,39.4 SODIMM.184 | 41.1,57.48 41.1,51.4 41.2,51.3 | 32.1,39.2 32.1,37.36
  Top 0.406: 32.4,43.6 32.4,39.4 32.1,39.4 32.1,39.2 | 74.04,55.63 R12.2 | 32.6,43.8 32.6,41.7 v33.5,41.7 | v5.3,49.9 8.57,49.9 8.61,49.87
  Top 0.508: 32.4,43.6 32.4,48 33.2,48.8 39.1,48.8 39.49,49.19 C13.1 40.67,50.77 41.2,51.3
  Bottom 0.406: v33.5,41.7 27.34,41.7 26.28,40.64 24.24,40.64 24.2,40.6 23.43,41.37 21.05,41.37 18.32,44.1 14.2,44.1 11.9,46.4 6.2,46.4 5.3,47.3 v5.3,49.9 5.3,50
  pour Top (no thermals): 6.93,53.67 8.63,53.67 8.63,48.07 6.93,48.07
VCC_3V3  (1 unrouted)
  Top 0.254: SODIMM.192 29.72,37.84 29.7,37.84 SODIMM.194 | 97.45,52.55 101,49 101,34.5 100.4,33.9 98.79,33.9 C18.1 | U1.4 13.3,50.79 13.93,50.17 19.93,50.17 20.83,51.07 20.83,54.37 20.08,55.12 C6.1 | SODIMM.193 30,45.46 30.29,45.75 SODIMM.191 | SODIMM.6 89.41,35.09 89.75,34.75 | C18.1 90.63,33.87 89.75,34.75 | SODIMM.4 90.01,35.01 89.75,34.75 | C18.1
  Top 0.305: SODIMM.191 30.31,48.41 31.47,49.57 31.57,49.57 33.92,51.92 33.92,56.15 35.5,57.73 35.5,58.3 | 30.01,35.69 30.2,35.5 30.35,35.35 31.2,34.5 74.3,34.5 75,35.2 SODIMM.42 75,39.4 75.31,39.71 SODIMM.41 75.31,47.51 75.8,48 76.87,48 | SODIMM.40 79.21,43.61 79.51,43.91 SODIMM.39 79.5,47.5 79,48 76.87,48 | U3.3 35.5,58.3 | 35.5,58.3 35.3,58.3 35.1,58.5 35.1,59.5 35.2,59.6 | 35.2,59.6 U3.1 | 35.2,59.6 35.06,59.74 C8.1 | 78.48,52.86 76.87,51.27 76.87,48
  Top 0.406: 78.48,52.85 78.48,52.86 78.53,52.87 C15.1 89.7,52.87 | 97.45,52.55 97.13,52.87 89.7,52.87 | 89.7,52.87 89.76,52.93 U2.4
  Top 0.508: 30,45.46 30,40.5 29.7,40.2 29.7,37.84 29.7,36 30.2,35.5
  Top 0.813: C6.1 18.53,56.77 18.5,56.8 21.3,56.8 23.1,55 23.1,37.5 24.05,36.55 | 24.05,36.55 26.7,33.9 28.9,33.9 30.35,35.35 | C12.1 24.05,36.55
  pour Top (no thermals): 17.43,60.57 19.03,60.57 19.03,54.67 17.43,54.67
VCC_5V  (via drill 0.45)  (4 unrouted)
  Top 0.25: U1.6 v14.21,51.6 v14.2,51.6
  Top 0.254: SODIMM.198 | IC2.3 77.27,60.75 C16.1 | R1.2 7.02,58.38 7,58.4 v6.9,58.4 | 17.1,44.43 C19.2
  Top 0.305: IC2.3 75.66,61.94 v75.6,62.2 | 27.9,37.84 SODIMM.200 28.19,37.55 SODIMM.198 | SODIMM.197 28.35,45.75 28.2,45.6 28.06,45.6 SODIMM.199
  Top 0.61: 1.6,46.3 1.6,15 3.2,13.4 83.2,13.4 86.4,10.2 86.4,7.47 JP7.1 | 1.6,46.3 1.6,58.2 2.6,59.2 4.4,59.2 5.8,60.6 5.8,63.8 6.19,64.19 9.8,64.19 10.37,63.62 JP1.2 | C19.2 15.73,45.8 13.1,45.8 12.6,46.3 1.6,46.3
  Top 0.813: 28.2,51.33 28.2,45.6 28.2,41.4 27.9,41.1 27.9,37.84 | JP3.VBUS 16.59,40.79 17.1,41.3 17.1,44.43
  Top 1.016: C11.1 28.2,51.33 29.2,52.33 29.2,58.6 | v29.2,59.9 29.2,58.6 | JP1.2 23.6,62.1 27.1,58.6 29.2,58.6
  Bottom 0.25: v14.2,51.6 12.5,51.6 12.2,51.9 v11.3,51.9
  Bottom 0.254: v6.9,58.4 6.9,59.6
  Bottom 0.305: v75.6,62.2 71.09,62.2 69.69,63.59 58.11,63.59 58.1,63.6 32.9,63.6
  Bottom 0.406: 6.9,59.6 10.37,59.6
  Bottom 0.508: 32.9,63.6 v29.2,59.9
  Bottom 1.016: v11.3,51.9 v10.2,51.9 10.37,52.07 10.37,59.6 JP1.2 14,62.1 15.7,60.4 15.7,56.5 15.6,56.4 15.5,56.5 v15,56.5 v16.3,56.5
  pour Top (no thermals): 9.63,53.27 11.23,53.27 11.53,52.97 11.93,52.97 11.93,51.47 9.63,51.47
  pour Top (no thermals): 14.23,55.47 14.23,56.87 16.83,56.87 16.83,54.97 15.13,54.97 14.73,55.37 14.33,55.37

### Text on the board
tPlace: GND | VIN | GND | 5V | GND | TV | GND | DOT | DIN | LRC | BCK | SCL | SCA | GND | GND | GND | GND | GPIO6 | GPIO5 | RXD | TXD